# EAGLE design Secret_Knock (EAGLE 9.4.2)
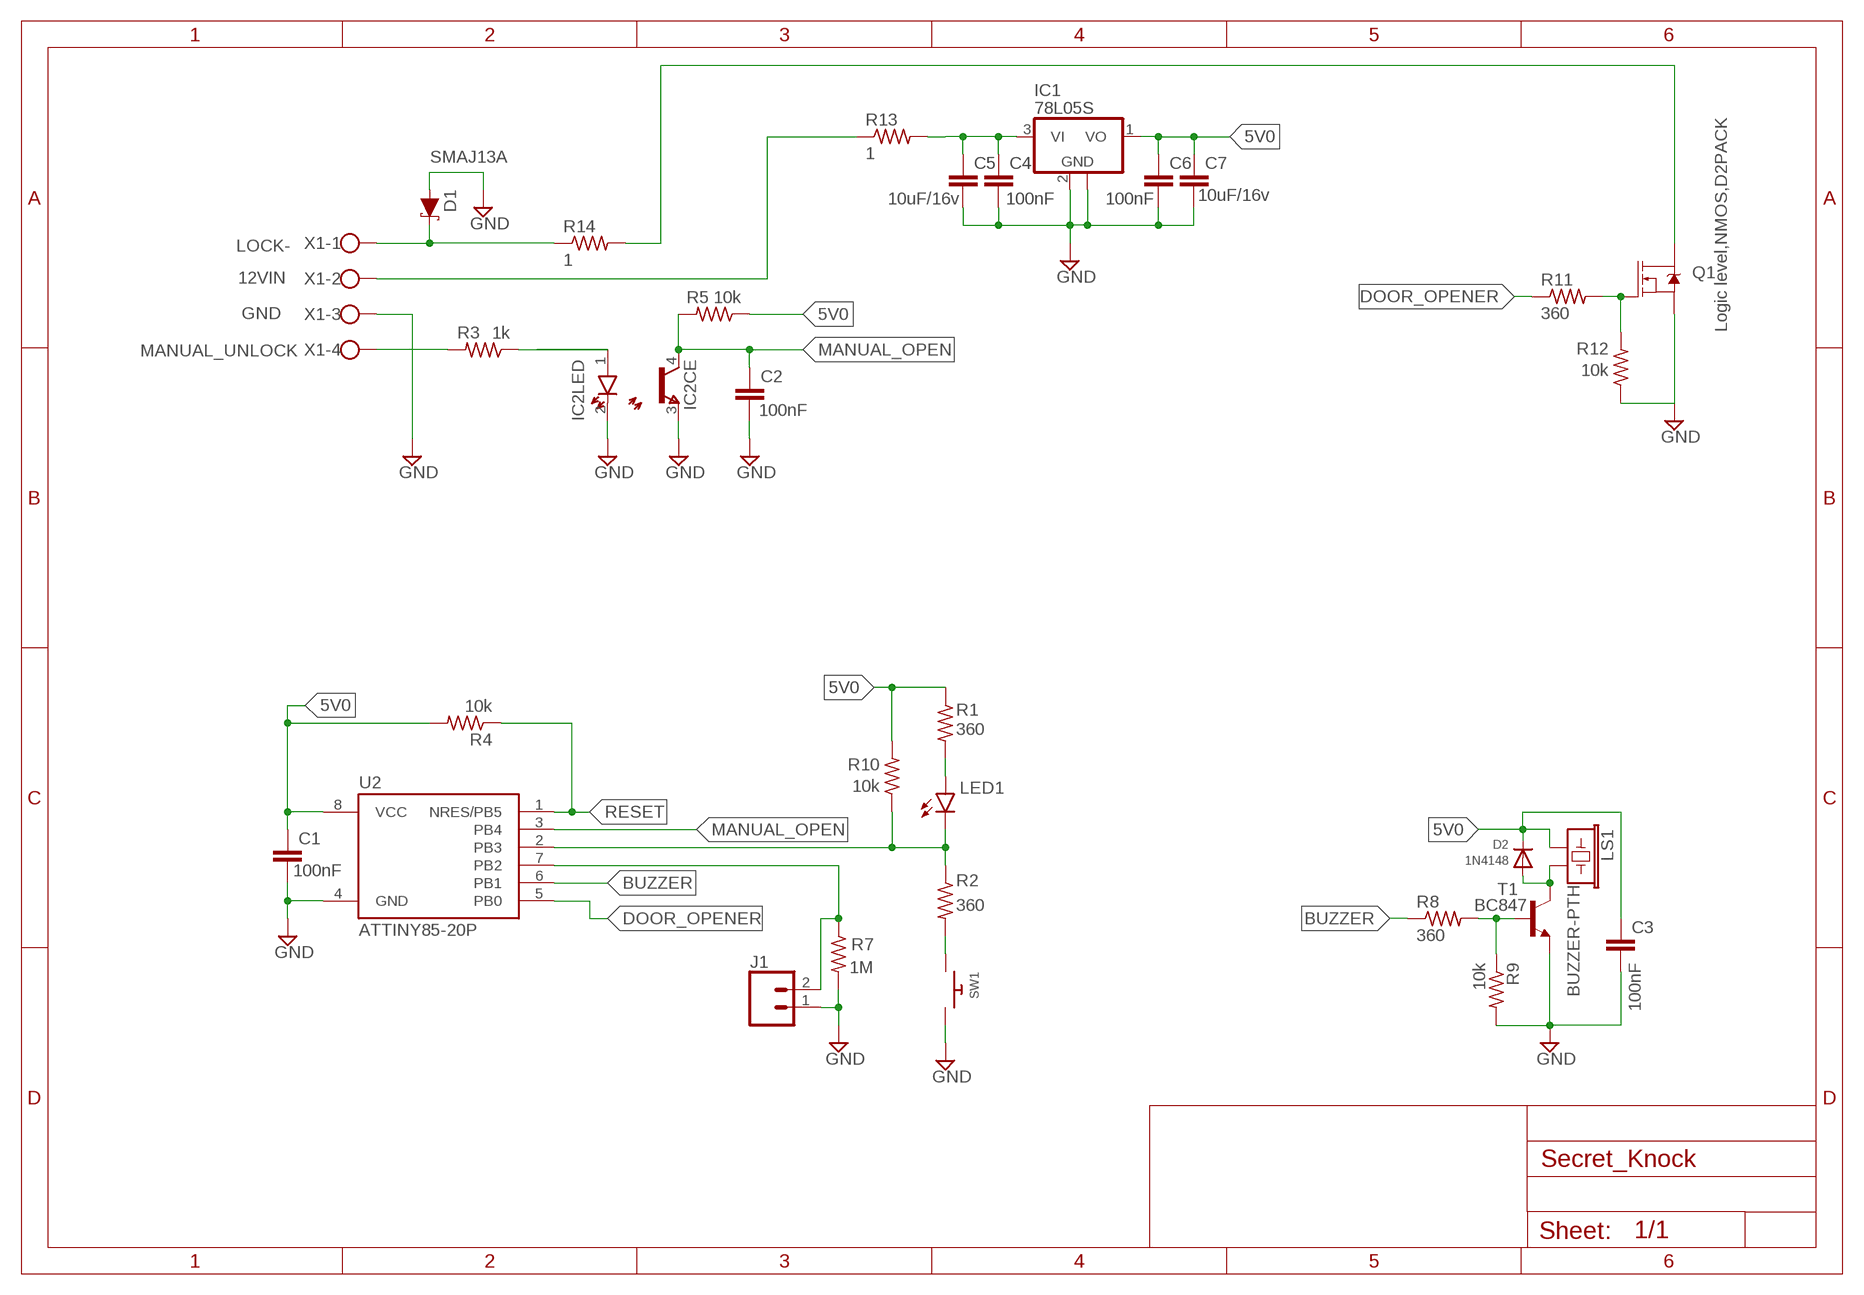
[diagram p0: schematic, sheet 1]

## Parts
C1  100nF  C-EUC0805  [C0805]
C2  100nF  C-EUC0805  [C0805]
C3  100nF  C-EUC0805  [C0805]
C4  100nF  C-EUC0805  [C0805]
C5  10uF/16v  C-EUC0805  [C0805]
C6  100nF  C-EUC0805  [C0805]
C7  10uF/16v  C-EUC0805  [C0805]
D1  SMAJ13A  DIODE-SCHOTTKY-SS14  [SMA-DIODE]
D2  1N4148  DIODESOD-123  [SOD-123]
IC1  78L05S  78L08F  [SOT89]
IC2  GENERIC OPTOCOUPLER, PC817  SFH6156  [SFH]
J1  CONN_02POLAR_LOCK  [MOLEX-1X2_LOCK]
LED1  LEDSML0805  [SML0805]
LS1  BUZZER-PTH  [BUZZER-12MM]
Q1  Logic level,NMOS,D2PACK  MOSFET-NCH-PSMN7R0  [TO-263/D2PAK]
R1  360  R-US_R0805  [R0805]
R2  360  R-US_R0805  [R0805]
R3  1k  R-US_R0805  [R0805]
R4  10k  R-US_R0805  [R0805]
R5  10k  R-US_R0805  [R0805]
R7  1M  R-US_R0805  [R0805]
R8  360  R-US_R0805  [R0805]
R9  10k  R-US_R0805  [R0805]
R10  10k  R-US_R0805  [R0805]
R11  360  R-US_R0805  [R0805]
R12  10k  R-US_R0805  [R0805]
R13  1  R-US_R0805  [R0805]
R14  1  R-US_R0805  [R0805]
SW1  SWITCH_PUSHBUTTONEVQ-PE  [TACT_PANA-EVQ]
T1  BC847  [SOT23]
U2  ATTINY85-20P  [PDIP08_300MIL]
X1  W237-4  [W237-4]

## Nets
5V0: C1.1 C3.1 C6.1 C7.1 D2.C IC1.1(VO) LS1.+ R1.1 R4.2 R5.1 R10.2 U2.8(VCC)
BUZZER: R8.1 U2.6(PB1)
DOOR_OPENER: R11.1 U2.5(PB0)
GND: C1.2 C2.2 C3.2 C4.2 C5.2 C6.2 C7.2 D1.A IC1.2(GND) IC1.2@1(GND) IC2.2(LED:K) IC2.3(CE:E) J1.1 Q1.3(S) R7.2 R9.2 R12.1 SW1.P$2 T1.2(E) U2.4(GND) X1.3
MANUAL_OPEN: C2.1 IC2.4(CE:C) R5.2 U2.3(PB4)
N$1: Q1.2(D) R14.2
N$2: LED1.A R1.2
N$3: R2.2 SW1.P$1
N$5: LED1.C R2.1 R10.1 U2.2(PB3)
N$6: R3.2 X1.4
N$7: IC2.1(LED:A) R3.1
N$8: D2.A LS1.- T1.3(C)
N$9: R8.2 R9.1 T1.1(B)
N$10: Q1.1(G) R11.2 R12.2
N$11: R13.1 X1.2
N$12: D1.C R14.1 X1.1
N$13: C4.1 C5.1 IC1.3(VI) R13.2
PIEZO_IN: J1.2 R7.1 U2.7(PB2)
RESET: R4.1 U2.1(NRES/PB5)

## Notes on the sheet
- LOCK-
- 12VIN
- GND
- MANUAL_UNLOCK

## Library data of the parts
C1-C7 = rcl:C-EU: CAPACITOR, European symbol; SPICEPREFIX: C
D1 = SparkFun-DiscreteSemi:DIODE-SCHOTTKY: Schottky diode A Schottky diode is a semiconductor diode which has a low forward voltage drop and a very fast switching action.; PROD_ID: DIO-08053; VALUE: 1A/40V/500mV
D2 = adafruit:DIODE: Diode SMADIODE - SMA Surface Mount Package 20V 1A Schottky Diode Digikey: 641-1014-6-ND DO-1N4148 - Through Hole Small Current Diode SOD-123 20V 1 A (.5mV Vf) Schottky Diode - Digikey: MBRX120TPMSCT-ND SOD-323 10V 570mA (.38mV Vf, 3ns) Schottky Diode - Digikey: ZLLS410CT-ND SOD-523 30V 30mA Schottky Diode (RB751S-40TE61) - Digikey: RB751S-40TE61CT-ND SOT23-R/W - SOT23 Package (R = Solder Paste/Reflow Ovens, W = Hand-Soldering) BAT54Film 40V 300mA - Digikey: 497-7162-1-ND
IC1 = linear:78L*: POSITOIV-VOLTAGE REGULATORS Output up to 100 mA Source: Datasheet <http://focus.ti.com/lit/ds/symlink/ua78l05.pdf>
IC2 = optocoupler:SFH6156: 5.3 kV TRIOS High Reliability Optocoupler; MF: VISHAY/TELEFUNKEN; MPN: SFH6156-4T; OC_FARNELL: 1612479; OC_NEWARK: 21H7733
J1 = SparkFun-Connectors:CONN_02: Multi connection point. Often used as Generic Header-pin footprint for 0.1 inch spaced/style header connections On any of the 0.1 inch spaced packages, you can populate with these: Break Away Headers - Straight <https://www.sparkfun.com/products/116> (PRT-00116) Break Away Male Headers - Right Angle <https://www.sparkfun.com/products/553> (PRT-00553) Female Headers <https://www.sparkfun.com/products/115> (PRT-00115) Break Away Headers - Machine Pin <https://www.sparkfun.com/products/117> (PRT-00117) Break Away Female Headers - Swiss Machine Pin <https://www.sparkfun.com/products/743> (PRT-00743) For SCREWTERMINALS and SPRING TERMINALS visit here: Screw Terimnals on SparkFun.com <https://www.sparkfun.com/search/results?term=Screw+Terminals> (5mm/3.5mm/2.54mm spacing) This device is also useful as a general connection point to wire up your design to another part of your project. Our various solder wires solder well into these plated through hole pads. Hook-Up Wire - Assortment (Stranded, 22 AWG) <https://www.sparkfun.com/products/11375> (PRT-11375) Hook-Up Wire - Assortment (Solid Core, 22 AWG) <https://www.sparkfun.com/products/11367> (PRT-11367) View the entire wire category on our website here <https://www.sparkfun.com/categories/141> Special notes: Molex polarized connector foot print use with: PRT-08233 with associated crimp pins and housings. 2.54_SCREWTERM for use with PRT-10571. 3.5mm Screw Terminal footprints for PRT-08084 5mm Screw Terminal footprints for use with PRT-08432; SF_ID: PRT-09918
LED1 = led:LED: LED OSRAM: - CHIPLED LG R971, LG N971, LY N971, LG Q971, LY Q971, LO R971, LY R971 LH N974, LH R974 LS Q976, LO Q976, LY Q976 LO Q996 - Hyper CHIPLED LW Q18S LB Q993, LB Q99A, LB R99A - SideLED LS A670, LO A670, LY A670, LG A670, LP A670 LB A673, LV A673, LT A673, LW A673 LH A674 LY A675 LS A676, LA A676, LO A676, LY A676, LW A676 LS A679, LY A679, LG A679 - Hyper Micro SIDELED® LS Y876, LA Y876, LO Y876, LY Y876 LT Y87S - SmartLED LW L88C, LW L88S LB L89C, LB L89S, LG L890 LS L89K, LO L89K, LY L89K LS L896, LA L896, LO L896, LY L896 - TOPLED LS T670, LO T670, LY T670, LG T670, LP T670 LSG T670, LSP T670, LSY T670, LOP T670, LYG T670 LG T671, LOG T671, LSG T671 LB T673, LV T673, LT T673, LW T673 LH T674 LS T676, LA T676, LO T676, LY T676, LB T676, LH T676, LSB T676, LW T676 LB T67C, LV T67C, LT T67C, LS T67K, LO T67K, LY T67K, LW E67C LS E67B, LA E67B, LO E67B, LY E67B, LB E67C, LV E67C, LT E67C LW T67C LS T679, LY T679, LG T679 LS T770, LO T770, LY T770, LG T770, LP T770 LB T773, LV T773, LT T773, LW T773 LH T774 LS E675, LA E675, LY E675, LS T675 LS T776, LA T776, LO T776, LY T776, LB T776 LHGB T686 LT T68C, LB T68C - Hyper Mini TOPLED® LB M676 - Mini TOPLED Santana® LG M470 LS M47K, LO M47K, LY M47K Source: http://www.osram.convergy.de LUXEON: - LUMILED® LXK2-PW12-R00, LXK2-PW12-S00, LXK2-PW14-U00, LXK2-PW14-V00 LXK2-PM12-R00, LXK2-PM12-S00, LXK2-PM14-U00 LXK2-PE12-Q00, LXK2-PE12-R00, LXK2-PE12-S00, LXK2-PE14-T00, LXK2-PE14-U00 LXK2-PB12-K00, LXK2-PB12-L00, LXK2-PB12-M00, LXK2-PB14-N00, LXK2-PB14-P00, LXK2-PB14-Q00 LXK2-PR12-L00, LXK2-PR12-M00, LXK2-PR14-Q00, LXK2-PR14-R00 LXK2-PD12-Q00, LXK2-PD12-R00, LXK2-PD12-S00 LXK2-PH12-R00, LXK2-PH12-S00 LXK2-PL12-P00, LXK2-PL12-Q00, LXK2-PL12-R00 Source: www.luxeon.com KINGBRIGHT: KA-3528ASYC Source: www.kingbright.com
LS1 = ARTIN961:BUZZER: Buzzer Small round buzzers that operate around the audible 2kHz range. You can use these as speakers to create simple music or user interfaces. Variant Overview: PTH - Mini Speaker - PC Mount 12mm 2.048kHz <https://www.sparkfun.com/products/7950> PTH_KIT - Mini Speaker - PC Mount 12mm 2.048kHz <https://www.sparkfun.com/products/7950> KIT simplifies soldering by adding stop mask to one side of the pads. PTH_NO_SILK - Mini Speaker - PC Mount 12mm 2.048kHz <https://www.sparkfun.com/products/7950> No silkscreen indicator of buzzer outline. PTH_KIT_NO_SILK - Mini Speaker - PC Mount 12mm 2.048kHz <https://www.sparkfun.com/products/7950> KIT package w/o silkscreen SMD - Buzzer Audio Magnetic (CCV-084B16) SMD buzzer used on, e.g. the LilyPad Buzzer <https://www.sparkfun.com/products/8463> and RFID USB Reader <https://www.sparkfun.com/products/9963>. SMD_KIT - Buzzer Audio Magnetic (CCV-084B16) SMD Buzzer with elongated pins to make soldering easier. Used on the SparkFun Simon Says - Surface Mount Soldering Kit <https://www.sparkfun.com/products/10935>.; PROD_ID: COMP-08253; SF_SKU: COM-07950
Q1 = SparkFun-DiscreteSemi:MOSFET-NCH: N-channel MOSFETs Voltage controlled devices that allow control of high current outputs. SparkFun Products: SparkFun OpenScale <https://www.sparkfun.com/products/13261> SparkFun Digital Sandbox <https://www.sparkfun.com/products/12651> SparkFun Monster Moto Shield <https://www.sparkfun.com/products/10182> SparkFun MOSFET Power Controller <https://www.sparkfun.com/products/11214>; PROD_ID: TRANS-12437; VALUE: 100A/100V/6.8mΩ
R1-R5 R7-R14 = rcl:R-US_: RESISTOR, American symbol; SPICEPREFIX: R
SW1 = adafruit:SWITCH_PUSHBUTTON: Buttons SOFTTOUCHSMD_SJ - Soft touch temporary push button (Super Junk Akihabara) Compatible with SKPMANE010 [Mouser: 688-SKPMAN] C&K_KSS = Digikey: KSS221GLFS
T1 = transistor:BC847: NPN TRANSISTOR
U2 = _hhn_attiny25_45_85:ATTINY85*: ATMEL ATtiny 85 Packages: P = PDIP 08 30mil S = SOIC 08 EIAJ 208mil Technologies Note: for complete ordering code (temp. range, finish, tape&reel etc.) see www.atmel.com • Supply Voltage: V = (1.8…5.5)V | [blank] = (2.7…5.5)V • Speed: 10 = 10 MHz | 20 = 20 MHz Author: Dipl.-Ing. FH Rainer Bayer HHN Hochschule Heilbronn (Heilbronn University), rainer.bayer@hs-heilbronn.de Ingenieurbüro ing-rb, mail@ing-rb.de
X1 = con-wago-500:W237-4: WAGO SCREW CLAMP; OC_FARNELL: unknown; OC_NEWARK: unknown

## Net classes
0 default: width 0.4 mm, drill 0.35 mm, clearance 0.2 mm

## Board
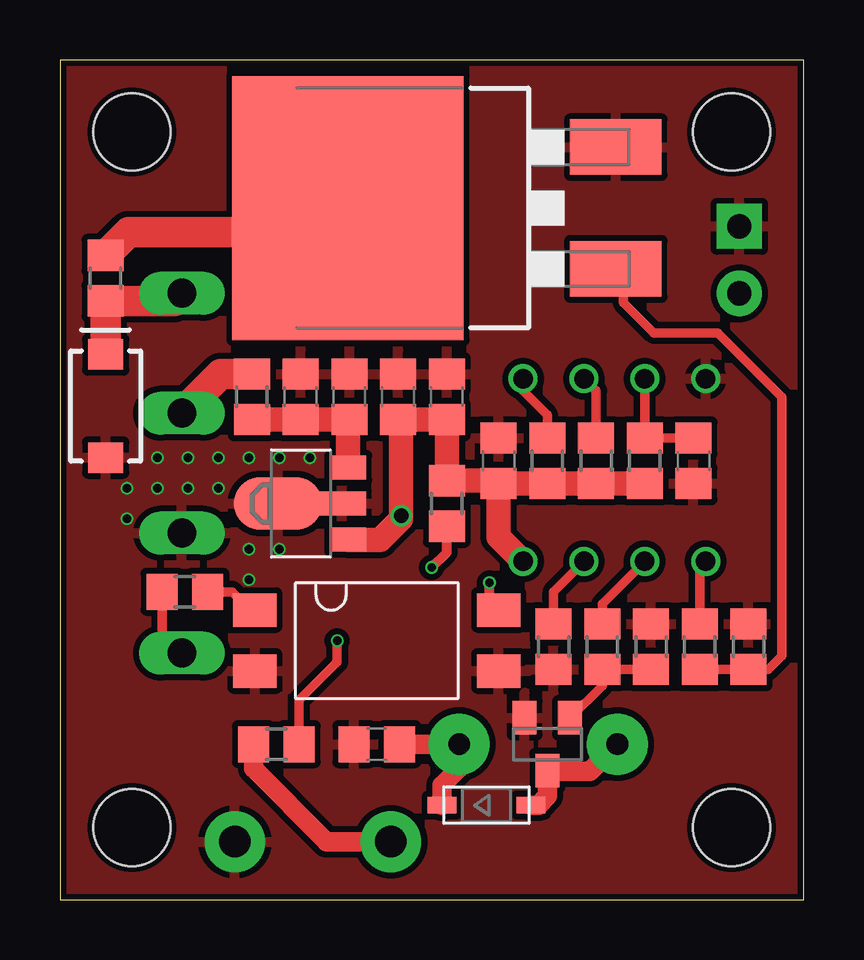
[diagram p1: board, top side]
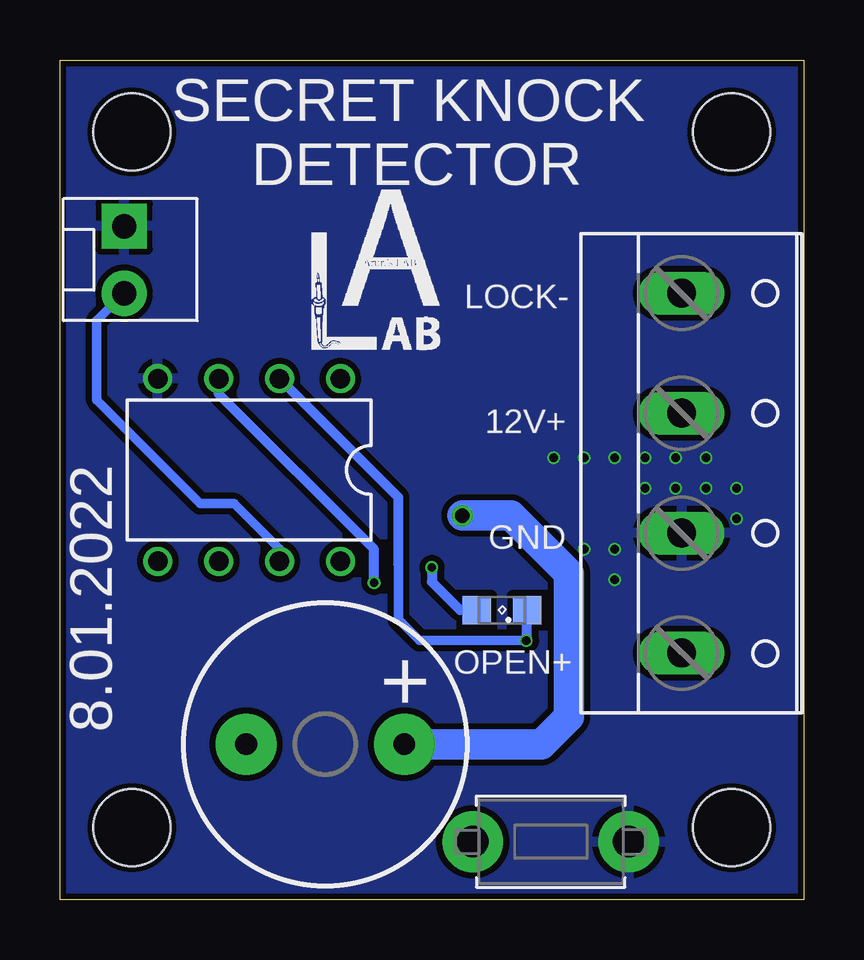
[diagram p2: board, bottom side, seen from below]

Size 31 x 35 mm. Coordinates in mm from the lower left corner, seen from the top.
Outline: 0,0 31,0 31,35 0,35 0,0
Copper layers (1*16): Top 0.035559375mm / dielectric 1.6mm / Bottom 0.035559375mm
Design rules "jlcpcb2layerTENTED_VIA": minimum track width 5mil, minimum drill 12mil, track to track 5mil, track to pad 5mil, pad to pad 5mil, via to via 5mil, smd to smd 5mil, copper to edge 8mil, drill to drill 6mil, minimum pad ring 5mil, minimum via ring 3mil, stop-mask expansion 2.5mil, vias tented up to drill 0.35mm, thermal gap 10mil
Holes 3.2 mm at 3,3 3,32 28,32 28,3

### Footprints (pad centres in the part's own frame; a part is rotated, then mirrored left to right if it is on the bottom)
C0805 = smd 1.3 x 1.5: 1 -0.95,0; 2 0.95,0
SMA-DIODE = smd 1.27 x 1.47: A -2.15,0; C 2.15,0
SOD-123 = smd 1.2 x 0.7: A 1.85,0; C -1.85,0
SOT89 = smd 1 x 1.5: 1 -1.499,-1.981; 3 1.499,-1.981 | smd 1 x 2: 2 0,-1.727 | smd 2.2 x 3.7: 2@1 0,0.94
SFH = smd 1.4 x 1.8: 1 1.27,5.08; 2 -1.27,5.08; 3 -1.27,-5.08; 4 1.27,-5.08
MOLEX-1X2_LOCK = drill 1.016 pad 1.88 square: 1 -0.127,0 | drill 1.016 pad 1.88: 2 2.667,0
SML0805 = smd 1.2 x 1.2: A 1.05,0; C -1.05,0
BUZZER-12MM = drill 0.9 pad 2.54: + 3.3,0; - -3.3,0
TO-263/D2PAK = smd 2.32 x 3.81: 1 -2.54,-7.045; 3 2.54,-7.045 | smd 11 x 9.65: 2 0,4.125
R0805 = smd 1.3 x 1.5: 1 -0.95,0; 2 0.95,0
TACT_PANA-EVQ = drill 1.3 pad 2.54: P$1 -3.25,0; P$2 3.25,0
SOT23 = smd 1 x 1.4: 1 -0.95,-1.1; 2 0.95,-1.1; 3 0,1.1
PDIP08_300MIL = drill 0.813: 1 -3.81,-3.81; 2 -1.27,-3.81; 3 1.27,-3.81; 4 3.81,-3.81; 5 3.81,3.81; 6 1.27,3.81; 7 -1.27,3.81; 8 -3.81,3.81
W237-4 = drill 1.194 long: 1 -7.5,-1.27; 2 -2.5,-1.27; 3 2.5,-1.27; 4 7.5,-1.27

### Placement (x,y rotation side)
C1  18.29,18.29 90 top
C2  26.42,18.29 270 top
C3  13.21,6.48 180 top
C4  10.03,20.95 90 top
C5  12.06,20.95 90 top
C6  14.1,20.95 90 top
C7  16.13,20.95 90 top
D1  1.91,20.57 90 top
D2  [SOD-123]  17.78,3.94 0 top
IC1  78L08F  [SOT89]  10.03,16.51 90 top
IC2  SFH6156  [SFH]  13.21,10.79 90 top
J1  28.32,27.94 270 bottom
LED1  12.57,12.06 180 bottom
LS1  19.94,6.48 0 bottom
Q1  16.13,28.83 90 top
R1  16.13,16.51 270 top
R2  9.02,6.48 180 top
R3  5.21,12.83 180 top
R4  20.32,18.29 270 top
R5  24.38,18.29 90 top
R7  20.57,10.54 270 top
R8  22.61,10.54 270 top
R9  24.64,10.54 90 top
R10  22.35,18.29 270 top
R11  26.67,10.54 270 top
R12  28.7,10.54 270 top
R13  8,20.95 270 top
R14  1.91,25.91 90 top
SW1  10.54,2.41 0 bottom
T1  20.32,6.48 180 top
U2  23.11,17.91 180 bottom
U$1  [ALAB_LOGO]  18.03,26.16 0 bottom
X1  3.81,17.78 270 bottom

### Tracks (layer width: path | path; a pad name or v marks a point on that pad's centre or on a via)
5V0  (via drill 0.6)
  Top 0.813: D2.C 15.93,4.75 16.64,5.46 LS1.+ C3.1
  Top 1.016: IC1.1 12.04,14.99 13.34,14.99 14.22,15.88 v14.22,16 14.22,19.88 C6.1 C7.1 R1.1 17.4,17.46 18.17,17.46 C1.1 | C1.1 R4.2 R10.2 R5.1 | U2.8 18.29,15.11 C1.1
  Bottom 1.27: LS1.+ 10.92,6.48 9.78,7.62 9.78,13.59 12.19,16 v14.22,16
BUZZER
  Top 0.4: U2.6 22.61,12.32 R8.1
DOOR_OPENER
  Top 0.4: R11.1 26.67,13.84 U2.5
GND  (via drill 0.35)
  other vias: 10.41,18.41 9.14,18.41 7.87,18.41 6.6,18.41 6.6,17.14 7.87,14.61 9.14,14.61 5.33,17.14 5.33,18.41 4.06,17.14 4.06,18.41 2.79,17.14 2.79,15.88 7.87,13.34
  pour Bottom (isolate 0.254): -5.08,36.83 -5.08,-3.81 44.45,-3.81 44.45,36.83
  pour Top (isolate 0.254): -3.81,36.83 -3.81,-3.81 45.72,-3.81 45.72,36.83
MANUAL_OPEN  (via drill 0.35)
  Top 0.4: C2.1 R5.2 U2.3
  Top 0.406: IC2.4 17.91,12.45 v17.91,13.21
  Bottom 0.406: v17.91,13.21 17.91,14.61 24.38,21.08 U2.3
N$1
  Top 1.27: Q1.2 12,28.51 10.86,27.37 10.41,27.81 2.86,27.81 R14.2
N$2  (via drill 0.35)
  Top 0.406: v15.49,13.84 16.13,14.48 R1.2
  Bottom 0.406: v15.49,13.84 15.49,13.24 14.32,12.06 LED1.A
N$3
  Top 0.813: SW1.P$1 11.12,2.41 8.07,5.47 R2.2
N$5  (via drill 0.35)
  Top 0.4: v11.56,10.79 11.56,9.91 11.49,9.84 9.97,8.32 R2.1 | R10.1 22.35,21.21 U2.2
  Bottom 0.4: 16.89,13.97 16.89,11.68 16,10.79 v11.56,10.79
  Bottom 0.406: v11.56,10.79 11.52,10.79 LED1.C | U2.2 16.89,16.76 16.89,13.97
N$6
  Top 0.4: R3.2 4.26,11.1 X1.4
N$7
  Top 0.4: IC2.1 7.93,12.06 7.17,12.83 R3.1
N$8
  Top 0.813: D2.A 19.94,3.94 20.32,4.32 T1.3 20.36,5.33 22.1,5.33 LS1.-
N$9
  Top 0.4: R9.1 R8.2 22.61,8.91 T1.1
N$10
  Top 0.4: Q1.1 23.3,26.16 23.5,26.16 23.5,24.89 24.77,23.62 27.43,23.62 30.1,20.95 30.1,10.16 29.53,9.59 R12.2 R11.2
N$11
  Top 1.27: X1.2 6.71,21.91 R13.1
N$12
  Top 1.27: X1.1 4.76,24.96 R14.1 D1.C
N$13
  Top 1.016: R13.2 C4.1 C5.1 12.01,19.95 IC1.3
PIEZO_IN
  Top 0.4: R7.1 20.57,12.83 U2.7
  Bottom 0.4: U2.7 21.84,14.61 23.75,16.51 25.15,16.51 29.46,20.83 29.46,24.13 J1.2
RESET
  Top 0.4: R4.1 20.32,20.19 19.3,21.21 U2.1

### Text on the board
bPlace: SECRET KNOCK / DETECTOR | LOCK- | 12V+ | GND | OPEN+ | 8.01.2022